# Altium schematic sheet [11]-TFT-Interface.SchDoc: TFT-Interface
size A3; Organization: Toradex AG; Address1: Altsagenstrasse 5; Address2: Horw; Address3: 6048; Address4: Switzerland; DocumentNumber: 10; Revision: V3.2; SheetNumber: 10; SheetTotal: 13; PageSetup: Record=PageOptions|CenterHorizontal=True|CenterVertical=True|PrintScale=0.73|XCorrection=1.00|YCorrection=1.00|PrintKind=0|BorderSize=5000000|LeftOffset=0|BottomOffset=0|Orientation=2|PaperLength=1000|PaperWidth=1000|Scale=100|PaperSource=7|PrintQuality=-4|MediaType=1|DitherType=10|PaperKind=A4|PrintScaleMode=1
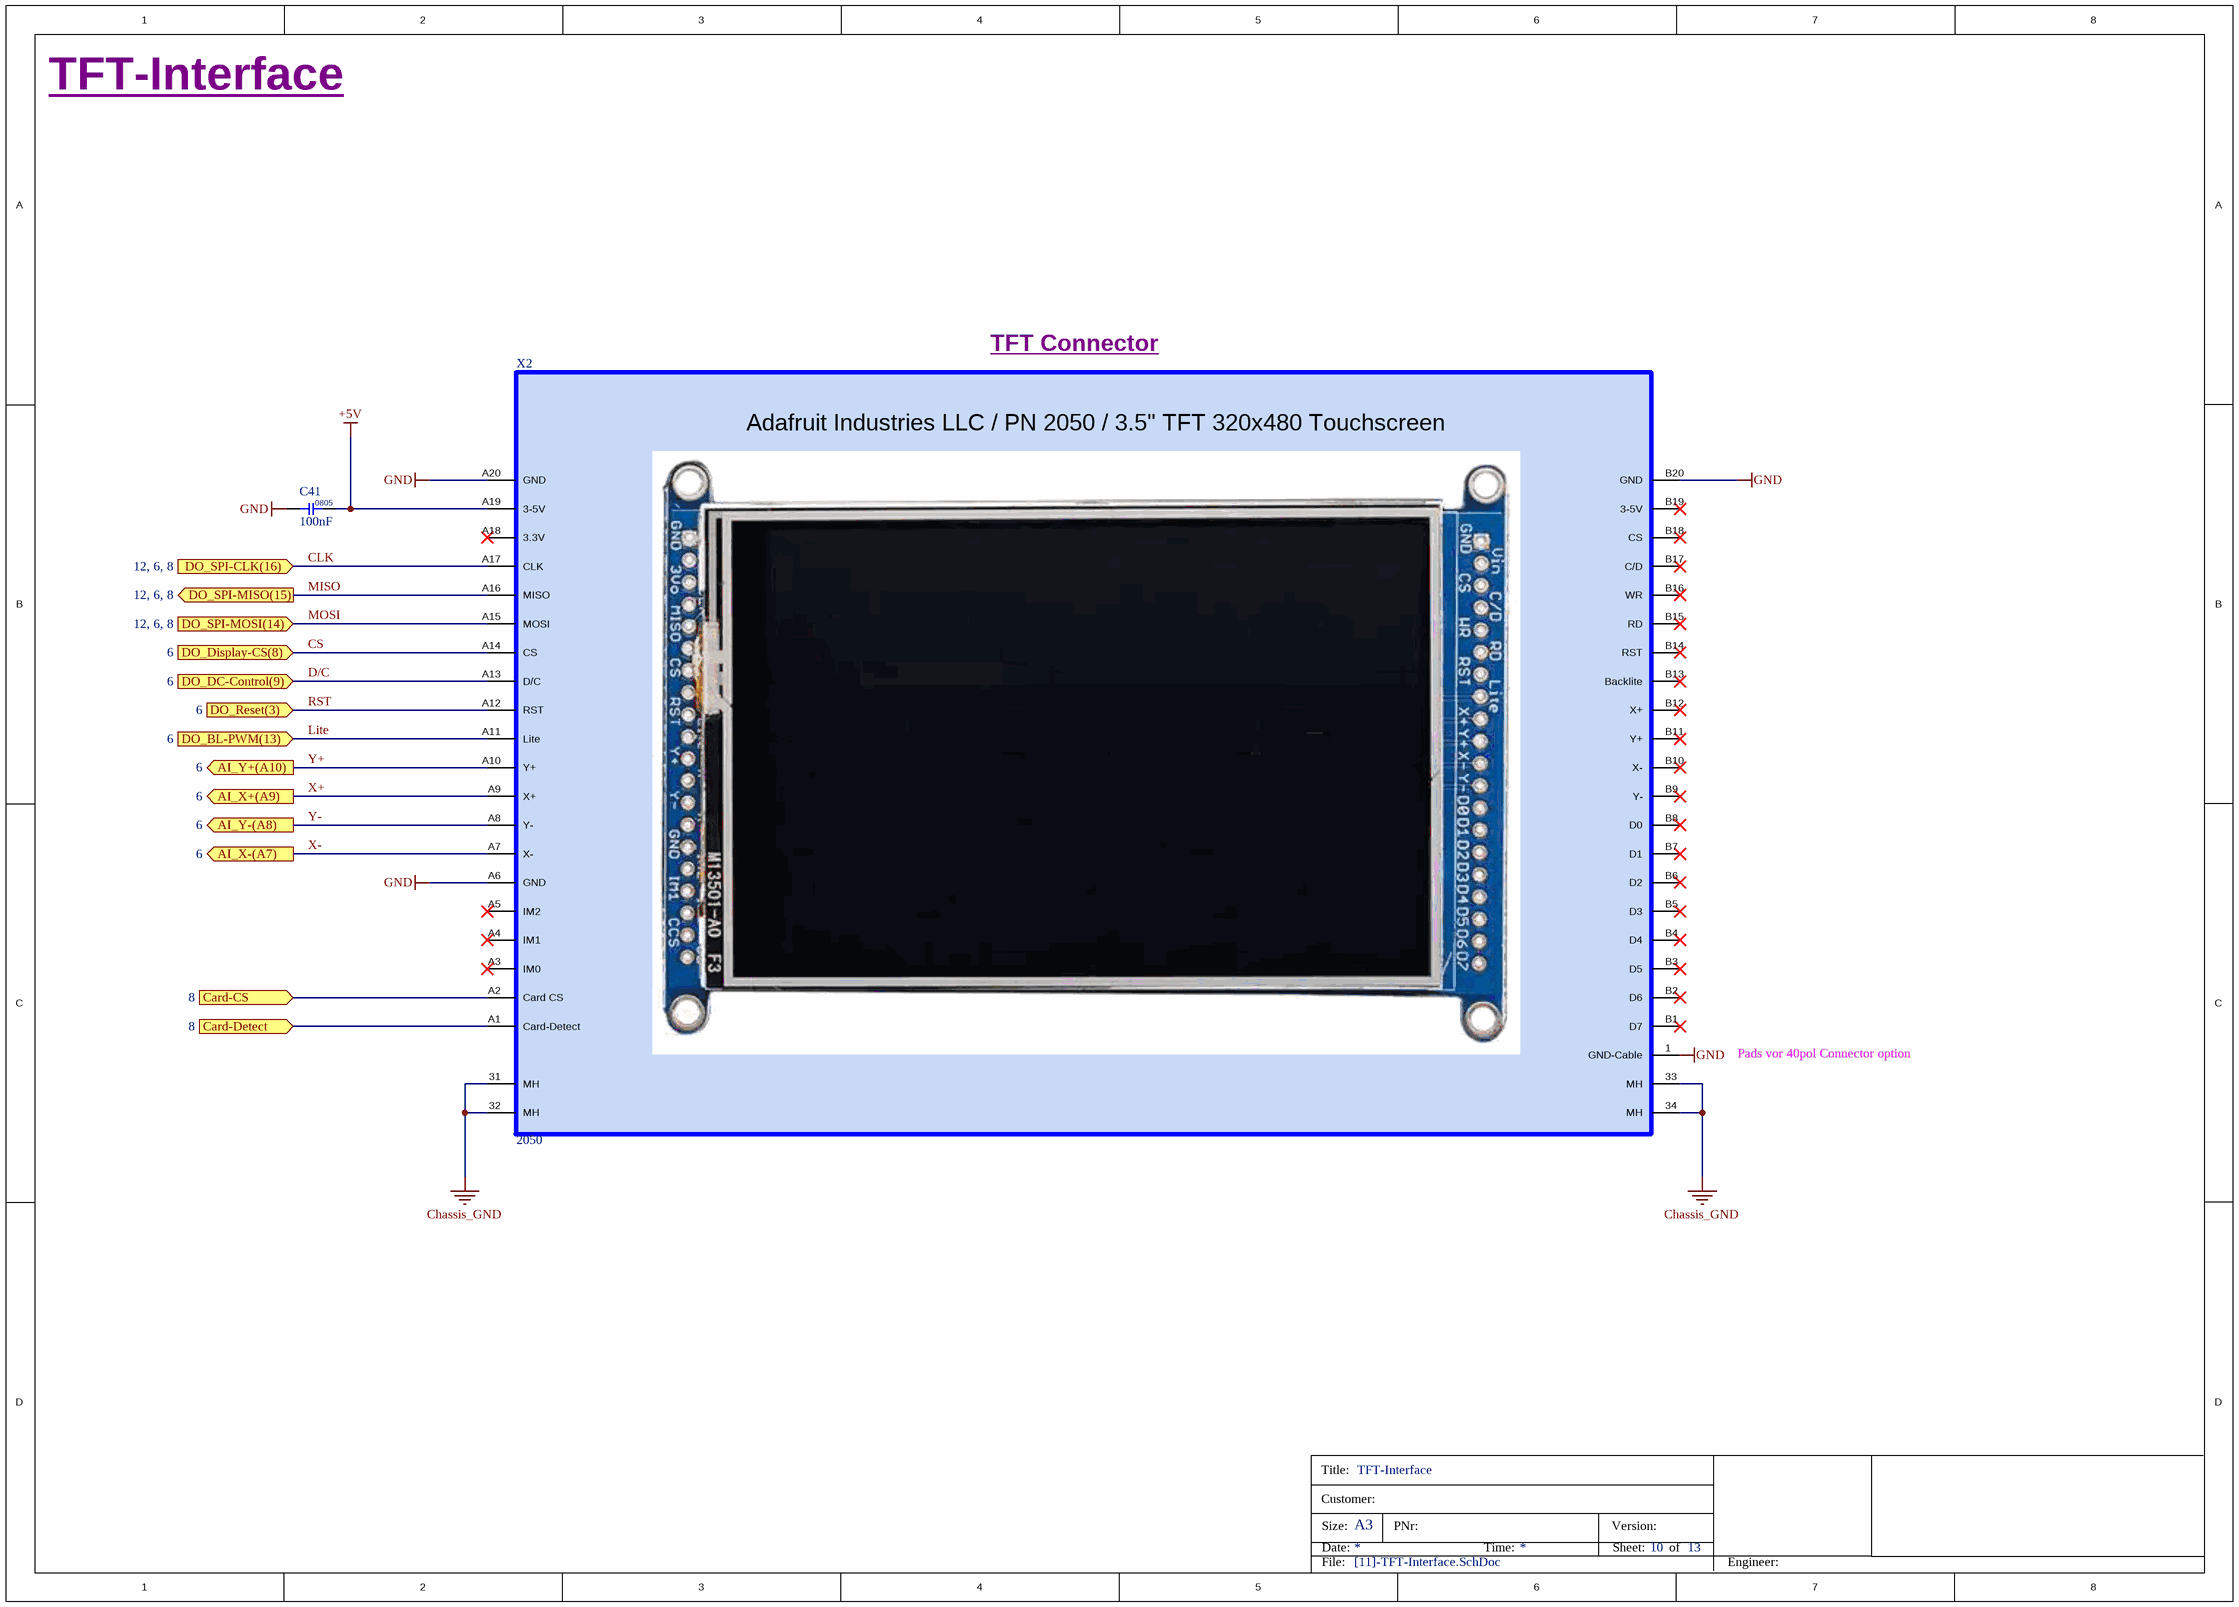
[diagram p0: [11]-TFT-Interface.SchDoc]

## Parts
C41  100nF  [C0805]
X2  2050  [CON_Adafruit35-TFT]

## Ports
AI_X+(A9) (out, see 6), AI_X-(A7) (out, see 6), AI_Y+(A10) (out, see 6), AI_Y-(A8) (out, see 6), Card-CS (in, see 8), Card-Detect (in, see 8), DO_BL-PWM(13) (in, see 6), DO_DC-Control(9) (in, see 6), DO_Display-CS(8) (in, see 6), DO_Reset(3) (in, see 6), DO_SPI-CLK(16) (in, see 12, 6, 8), DO_SPI-MISO(15) (out, see 12, 6, 8), DO_SPI-MOSI(14) (in, see 12, 6, 8)

## Nets
+5V: C41.2 X2.A19(3-5V)
Chassis_GND: X2.31(MH) X2.32(MH) X2.33(MH) X2.34(MH)
GND: C41.1 X2.1(GND-Cable) X2.A6(GND) X2.A20(GND) X2.B20(GND)
Card-CS: X2.A2(Card_CS) ; port Card-CS
Card-Detect: X2.A1(Card-Detect) ; port Card-Detect
CLK: X2.A17(CLK) ; port DO_SPI-CLK(16)
CS: X2.A14(CS) ; port DO_Display-CS(8)
D/C: X2.A13(D/C) ; port DO_DC-Control(9)
Lite: X2.A11(Lite) ; port DO_BL-PWM(13)
MISO: X2.A16(MISO) ; port DO_SPI-MISO(15)
MOSI: X2.A15(MOSI) ; port DO_SPI-MOSI(14)
RST: X2.A12(RST) ; port DO_Reset(3)
X+: X2.A9(X+) ; port AI_X+(A9)
X-: X2.A7(X-) ; port AI_X-(A7)
Y+: X2.A10(Y+) ; port AI_Y+(A10)
Y-: X2.A8(Y-) ; port AI_Y-(A8)

Not connected (* = marked no-connect by the designer): X2 A3(IM0)* A4(IM1)* A5(IM2)* A18(3.3V)* B1(D7)* B2(D6)* B3(D5)* B4(D4)* B5(D3)* B6(D2)* B7(D1)* B8(D0)* B9(Y-)* B10(X-)* B11(Y+)* B12(X+)* B13(Backlite)* B14(RST)* B15(RD)* B16(WR)* B17(C/D)* B18(CS)* B19(3-5V)*

## Notes on the sheet
- TFT Connector
- Pads vor 40pol Connector option
- Title:
- Customer:
- Size:
- Date:
- A3
- PNr:
- Time:
- Version:
- Sheet:
- of
- File:
- Engineer:
- Title
- Number:
- Revision:
- Sheet
- (in symbol CON_Modul-TFT-3.5in_2050) Adafruit Industries LLC / PN 2050 / 3.5" TFT 320x480 Touchscreen

## Library data of the parts
C41 = C_100nF_CC0805KRX7R9BB104: CAP CER 0.1UF 50V X7R 0805; Manufacturer: Yageo; Material: Ceramic; Tolerance: 10%; Insulation Resistance: 100GR; PCBChecked: initials after Checked; Supplier 1: Digi-Key; Manufacturer Part Number: CC0805KRX7R9BB104; RoHS: Yes; Category: Ceramic Capacitors; Mount: Surface Mount; Case/Package: 0805; Number of Pins: 2; Case Code (Metric): 2012; Case Code (Imperial): 0805; Min Operating Temperature: -55°C; Max Operating Temperature: 125°C; Packaging: Tape and Reel; Capacitance: 100nF; Voltage Rating: 50V; Package Quantity: 1; Dielectric: X7R; Termination: SMD/SMT; Voltage: 50V; Length: 2mm; Height: 0.85mm; Width: 0.049inch; Thickness: 0.033inch; Depth: 1.25mm; Radiation Hardening: No; REACH SVHC: No SVHC; Lead Free: Lead Free; Halogen Free: Halogen Free; ComponentLink1URL: https://datasheet.ciiva.com/11786/0900766b80d84f1d-11786009.pdf?src-supplier=RSComponents; ComponentLink1Description: https://datasheet.ciiva.com/11786/0900766b80d84f1d-11786009.pdf?src-supplier=RSComponents; ComponentLink2URL: https://datasheet.ciiva.com/11464/upy-gphc-x7r-6-3v-to-50v-8-11464757.pdf?src-supplier=Avnet; ComponentLink2Description: https://datasheet.ciiva.com/11464/upy-gphc-x7r-6-3v-to-50v-8-11464757.pdf?src-supplier=Avnet; ComponentLink3URL: https://datasheet.ciiva.com/28450/1489800-28450805.pdf?src-supplier=Element14; ComponentLink3Description: https://datasheet.ciiva.com/28450/1489800-28450805.pdf?src-supplier=Element14; ComponentLink4URL: https://datasheet.ciiva.com/155/mlccorderingcode-155929.pdf?src-supplier=Digi-Key; ComponentLink4Description: https://datasheet.ciiva.com/155/mlccorderingcode-155929.pdf?src-supplier=Digi-Key; ComponentLink5URL: https://datasheet.ciiva.com/155/mlccorderingcode-155930.pdf?src-supplier=Digi-Key; ComponentLink5Description: https://datasheet.ciiva.com/155/mlccorderingcode-155930.pdf?src-supplier=Digi-Key; ComponentLink6URL: https://datasheet.ciiva.com/155/mlccorderingcode-155931.pdf?src-supplier=Digi-Key; ComponentLink6Description: https://datasheet.ciiva.com/155/mlccorderingcode-155931.pdf?src-supplier=Digi-Key; ComponentLink7URL: https://datasheet.ciiva.com/46393/1734573-46393307.pdf?src-supplier=Element14; ComponentLink7Description: https://datasheet.ciiva.com/46393/1734573-46393307.pdf?src-supplier=Element14; ComponentLink8URL: https://datasheet.ciiva.com/16625/upy-gphc-x7r-6-3v-to-50v-8-16625549.pdf?src-supplier=Avnet+Europe; ComponentLink8Description: https://datasheet.ciiva.com/16625/upy-gphc-x7r-6-3v-to-50v-8-16625549.pdf?src-supplier=Avnet+Europe; ComponentLink9URL: https://datasheet.ciiva.com/29242/445210-da-01-en-kerko-chip-0805-x7r-0-1uf-10proz-50vg-29242074.pdf?src-supplier=Conrad; ComponentLink9Description: https://datasheet.ciiva.com/29242/445210-da-01-en-kerko-chip-0805-x7r-0-1uf-10proz-50vg-29242074.pdf?src-supplier=Conrad; Supplier Part Number 1: 311-1140-6-ND; Stock 1: 7118979; IPC7352C: done; SCHChecked: Initials after checked
X2 = CON_Modul-TFT-3.5in_2050: 3.5" TFT 320X480 TOUCHSCREEN; Manufacturer: Adafruit Industries; Touchscreen: Resistive; Backlight Type: LED; Resolution (height): 480pixel; Resolution (width): 320pixel; Interface: Serial,Parallel; Diagonal Size: 3.5inch; Supplier 1: Mouser; Manufacturer Part Number: 2050; RoHS: Yes; Category: LCD, OLED, Graphic Displays; Stock 1: 417; ComponentLink1URL: http://www.alliedelec.com/m/d/9756519adc26e8471e8a5fa3971ddbc7.pdf?src-supplier=Allied+Electronics; ComponentLink1Description: http://www.alliedelec.com/m/d/9756519adc26e8471e8a5fa3971ddbc7.pdf?src-supplier=Allied+Electronics; ComponentLink2URL: https://cdn-shop.adafruit.com/datasheets/HX8357-D_DS_April2012.pdf?src-supplier=Digi-Key; ComponentLink2Description: https://cdn-shop.adafruit.com/datasheets/HX8357-D_DS_April2012.pdf?src-supplier=Digi-Key; Supplier Part Number 1: 485-2050